# Altium project 大功率h桥.PrjPcb
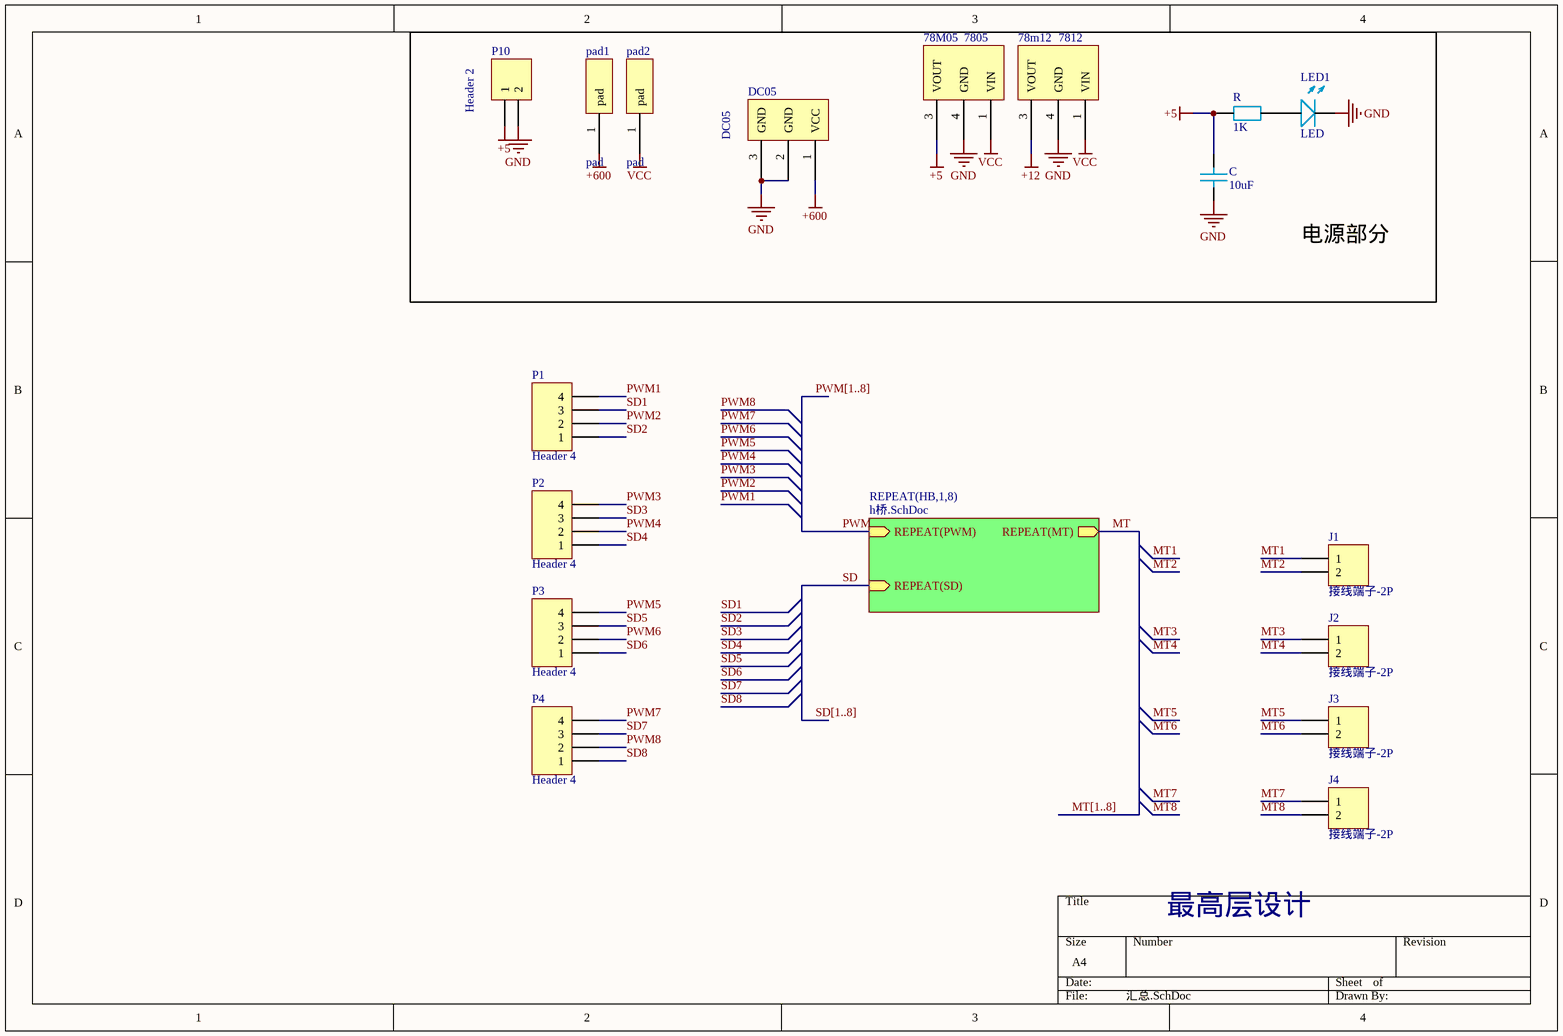
[diagram p0: 汇总.SchDoc]
2 sheets, 113 parts. Net scope: hierarchical (ports join the sheet entries above them; power ports are global).
Board file: h桥.PcbDoc
Sheets:
  汇总.SchDoc
    HB1 = h桥.SchDoc
    HB2 = h桥.SchDoc
    HB3 = h桥.SchDoc
    HB4 = h桥.SchDoc
    HB5 = h桥.SchDoc
    HB6 = h桥.SchDoc
    HB7 = h桥.SchDoc
    HB8 = h桥.SchDoc

## Sheet 汇总.SchDoc
size A4

### Parts
78M05  7805  [78M05]
78m12  7812  [78M05]
C  10uF  [0805_C]
DC05  DC05  [DC-005 - duplicate]
J1  接线端子-2P  [KF128-5.08-2P]
J2  接线端子-2P  [KF128-5.08-2P]
J3  接线端子-2P  [KF128-5.08-2P]
J4  接线端子-2P  [KF128-5.08-2P]
LED1  LED  [LED_0805]
P1  Header 4  [MX 1.25-WS-4P]
P2  Header 4  [MX 1.25-WS-4P]
P3  Header 4  [MX 1.25-WS-4P]
P4  Header 4  [MX 1.25-WS-4P]
P10  Header 2  [HDR1X2]
pad1  pad  [PAD3*3]
pad2  pad  [PAD3*3]
R  1K  [0805_R]

### Blocks framed on the sheet
电源部分: 78M05 78m12 C DC05 LED1 P10 pad1 pad2 R

### Sub-sheets
REPEAT(HB,1,8) = h桥.SchDoc: REPEAT(PWM) (in), REPEAT(SD) (in), REPEAT(MT) (out)

### Nets
+5: 78M05.3(VOUT) C.1 P10.1 R.1
+12: 78m12.3(VOUT)
+600: DC05.1(VCC) pad1.1(pad)
GND: 78M05.4(GND) 78m12.4(GND) C.2 DC05.2(GND) DC05.3(GND) LED1.2 P10.2
VCC: 78M05.1(VIN) 78m12.1(VIN) pad2.1(pad)
MT: sheet REPEAT(HB,1,8)/REPEAT(MT)
MT1: J1.1
MT2: J1.2
MT3: J2.1
MT4: J2.2
MT5: J3.1
MT6: J3.2
MT7: J4.1
MT8: J4.2
PWM: sheet REPEAT(HB,1,8)/REPEAT(PWM)
PWM1: P1.4
PWM2: P1.2
PWM3: P2.4
PWM4: P2.2
PWM5: P3.4
PWM6: P3.2
PWM7: P4.4
PWM8: P4.2
SD: sheet REPEAT(HB,1,8)/REPEAT(SD)
SD1: P1.3
SD2: P1.1
SD3: P2.3
SD4: P2.1
SD5: P3.3
SD6: P3.1
SD7: P4.3
SD8: P4.1
NetLED1_1: LED1.1 R.2

### Buses and harness runs
bus MT[1..8]
bus PWM[1..8]
bus SD[1..8]

### Notes on the sheet
- 最高层设计

### Library data of the parts
78m12 = 7805
C = C
DC05 = DC05: DC05电源
J1-J4 = 接线端子-2P: 通用接线端子
P1-P4 = Header 4: Header, 4-Pin; LatestRevisionDate: 17-Jul-2002; LatestRevisionNote: Re-released for DXP Platform.; Publisher: Altium Limited
P10 = Header 2: Header, 2-Pin; LatestRevisionDate: 17-Jul-2002; LatestRevisionNote: Re-released for DXP Platform.; Publisher: Altium Limited
pad1 pad2 = pad1
R = R

## Sheet h桥.SchDoc
size A4
Used 8 times, as channels HB1, HB2, HB3, HB4, HB5, HB6, HB7, HB8. Parts and nets are listed once, with the designators drawn on the sheet.
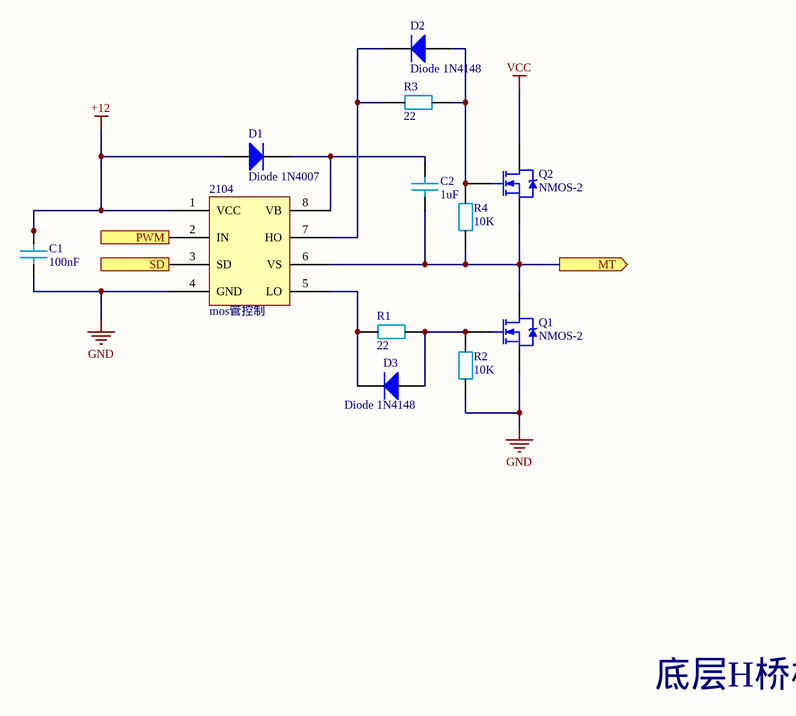
[diagram p1: h桥.SchDoc]

### Parts
2104  mos管控制  [SOP8]
C1  100nF  [0805_C]
C2  1uF  [0805_C]
D1  Diode 1N4007  [DO-41]
D2  Diode 1N4148  [DO-35]
D3  Diode 1N4148  [DO-35]
Q1  NMOS-2  [LC-TO-252-2]
Q2  NMOS-2  [LC-TO-252-2-180]
R1  22  [0805_R]
R2  10K  [0805_R]
R3  22  [0805_R]
R4  10K  [0805_R]

### Ports
MT (out), PWM (in), SD (in)

### Nets
+12: 2104.1(VCC) C1.2 D1.1(A)
GND: 2104.4(GND) C1.1 Q1.3(S) R2.2
VCC: Q2.2(D)
MT: 2104.6(VS) C2.1 Q1.2(D) Q2.3(S) R4.1 ; port MT
PWM: 2104.2(IN) ; port PWM
SD: 2104.3(SD) ; port SD
Net2104_5: 2104.5(LO) D3.2(K) R1.1
Net2104_7: 2104.7(HO) D2.2(K) R3.1
Net2104_8: 2104.8(VB) C2.2 D1.2(K)
NetD2_1: D2.1(A) Q2.1(G) R3.2 R4.2
NetD3_1: D3.1(A) Q1.1(G) R1.2 R2.1

### Channels
HB1: designators end in _HB1; ports MT=MT1 PWM=PWM1 SD=SD1
HB2: designators end in _HB2; ports MT=MT2 PWM=PWM2 SD=SD2
HB3: designators end in _HB3; ports MT=MT3 PWM=PWM3 SD=SD3
HB4: designators end in _HB4; ports MT=MT4 PWM=PWM4 SD=SD4
HB5: designators end in _HB5; ports MT=MT5 PWM=PWM5 SD=SD5
HB6: designators end in _HB6; ports MT=MT6 PWM=PWM6 SD=SD6
HB7: designators end in _HB7; ports MT=MT7 PWM=PWM7 SD=SD7
HB8: designators end in _HB8; ports MT=MT8 PWM=PWM8 SD=SD8

### Notes on the sheet
- 底层H桥模块

### Library data of the parts
2104 = eg2104
C1 C2 = C
D1 = Diode 1N4007: 1 Amp General Purpose Rectifier; Published: 8-Jun-2000; LatestRevisionDate: 17-Jul-2002; LatestRevisionNote: Re-released for DXP Platform.; DatasheetVersion: 1998; PackageVersion: Aug-1999; PackageReference: DO-41; Publisher: Altium Limited; PackageDescription: Diode, Axial; Body 5.2 x 2.7 mm (LxDia. max), Lead Dia. 0.86 mm (max); Code_JEDEC: DO-204-AL; ComponentLink1Description: Manufacturer Link; ComponentLink1URL: http://www.fairchildsemi.com/; ComponentLink2Description: Datasheet; ComponentLink2URL: http://www.fairchildsemi.com/ds/1N%2F1N4001.pdf
D2 D3 = Diode 1N4148: High Conductance Fast Diode; Published: 8-Jun-2000; LatestRevisionDate: 17-Jul-2002; LatestRevisionNote: Re-released for DXP Platform.; DatasheetVersion: 1997; PackageReference: DO-35; Publisher: Altium Limited; PackageDescription: Diode, Axial; Body 3.8 x 1.9 mm (LxDia. max), Lead Dia. 0.53 mm (max); Code_JEDEC: DO-204-AH; ComponentLink1Description: Manufacturer Link; ComponentLink1URL: http://www.fairchildsemi.com/; ComponentLink2Description: Datasheet; ComponentLink2URL: http://www.fairchildsemi.com/ds/1N%2F1N4148.pdf
Q1 Q2 = NMOS-2: N-Channel Power MOSFET; Note: Pin 2 is electrically connected to pin 4.; Published: 8-Jun-2000; LatestRevisionDate: 17-Jul-2002; LatestRevisionNote: Re-released for DXP Platform.; DatasheetVersion: PD-9.814; PackageVersion: Feb-1997; PackageReference: TO-220AB; Publisher: Altium Limited; PackageDescription: TO, Thru-Hole, Vertical, Heatsink Mounted; 3 In-Line Leads; Pitch 2.54 mm; ComponentLink1Description: Manufacturer Link; ComponentLink1URL: http://www.irf.com/
R1-R4 = R

## Nets that join several sheets
+12: 汇总 (78m12.3), HB1 (2104_HB1.1 C1_HB1.2 D1_HB1.1), HB2 (2104_HB2.1 C1_HB2.2 D1_HB2.1), HB3 (2104_HB3.1 C1_HB3.2 D1_HB3.1), HB4 (2104_HB4.1 C1_HB4.2 D1_HB4.1), HB5 (2104_HB5.1 C1_HB5.2 D1_HB5.1), HB6 (2104_HB6.1 C1_HB6.2 D1_HB6.1), HB7 (2104_HB7.1 C1_HB7.2 D1_HB7.1), HB8 (2104_HB8.1 C1_HB8.2 D1_HB8.1)
GND: 汇总 (7 pins), HB1 (2104_HB1.4 C1_HB1.1 Q1_HB1.3 R2_HB1.2), HB2 (2104_HB2.4 C1_HB2.1 Q1_HB2.3 R2_HB2.2), HB3 (2104_HB3.4 C1_HB3.1 Q1_HB3.3 R2_HB3.2), HB4 (2104_HB4.4 C1_HB4.1 Q1_HB4.3 R2_HB4.2), HB5 (2104_HB5.4 C1_HB5.1 Q1_HB5.3 R2_HB5.2), HB6 (2104_HB6.4 C1_HB6.1 Q1_HB6.3 R2_HB6.2), HB7 (2104_HB7.4 C1_HB7.1 Q1_HB7.3 R2_HB7.2), HB8 (2104_HB8.4 C1_HB8.1 Q1_HB8.3 R2_HB8.2)
VCC: 汇总 (78M05.1 78m12.1 pad2.1), HB1 (Q2_HB1.2), HB2 (Q2_HB2.2), HB3 (Q2_HB3.2), HB4 (Q2_HB4.2), HB5 (Q2_HB5.2), HB6 (Q2_HB6.2), HB7 (Q2_HB7.2), HB8 (Q2_HB8.2)
MT1: 汇总 (J1.1), HB1 (5 pins)
MT2: 汇总 (J1.2), HB2 (5 pins)
MT3: 汇总 (J2.1), HB3 (5 pins)
MT4: 汇总 (J2.2), HB4 (5 pins)
MT5: 汇总 (J3.1), HB5 (5 pins)
MT6: 汇总 (J3.2), HB6 (5 pins)
MT7: 汇总 (J4.1), HB7 (5 pins)
MT8: 汇总 (J4.2), HB8 (5 pins)
PWM1: 汇总 (P1.4), HB1 (2104_HB1.2)
PWM2: 汇总 (P1.2), HB2 (2104_HB2.2)
PWM3: 汇总 (P2.4), HB3 (2104_HB3.2)
PWM4: 汇总 (P2.2), HB4 (2104_HB4.2)
PWM5: 汇总 (P3.4), HB5 (2104_HB5.2)
PWM6: 汇总 (P3.2), HB6 (2104_HB6.2)
PWM7: 汇总 (P4.4), HB7 (2104_HB7.2)
PWM8: 汇总 (P4.2), HB8 (2104_HB8.2)
SD1: 汇总 (P1.3), HB1 (2104_HB1.3)
SD2: 汇总 (P1.1), HB2 (2104_HB2.3)
SD3: 汇总 (P2.3), HB3 (2104_HB3.3)
SD4: 汇总 (P2.1), HB4 (2104_HB4.3)
SD5: 汇总 (P3.3), HB5 (2104_HB5.3)
SD6: 汇总 (P3.1), HB6 (2104_HB6.3)
SD7: 汇总 (P4.3), HB7 (2104_HB7.3)
SD8: 汇总 (P4.1), HB8 (2104_HB8.3)